# Altium project UAARG Autopilot.PrjPcb (part 3 of 3)
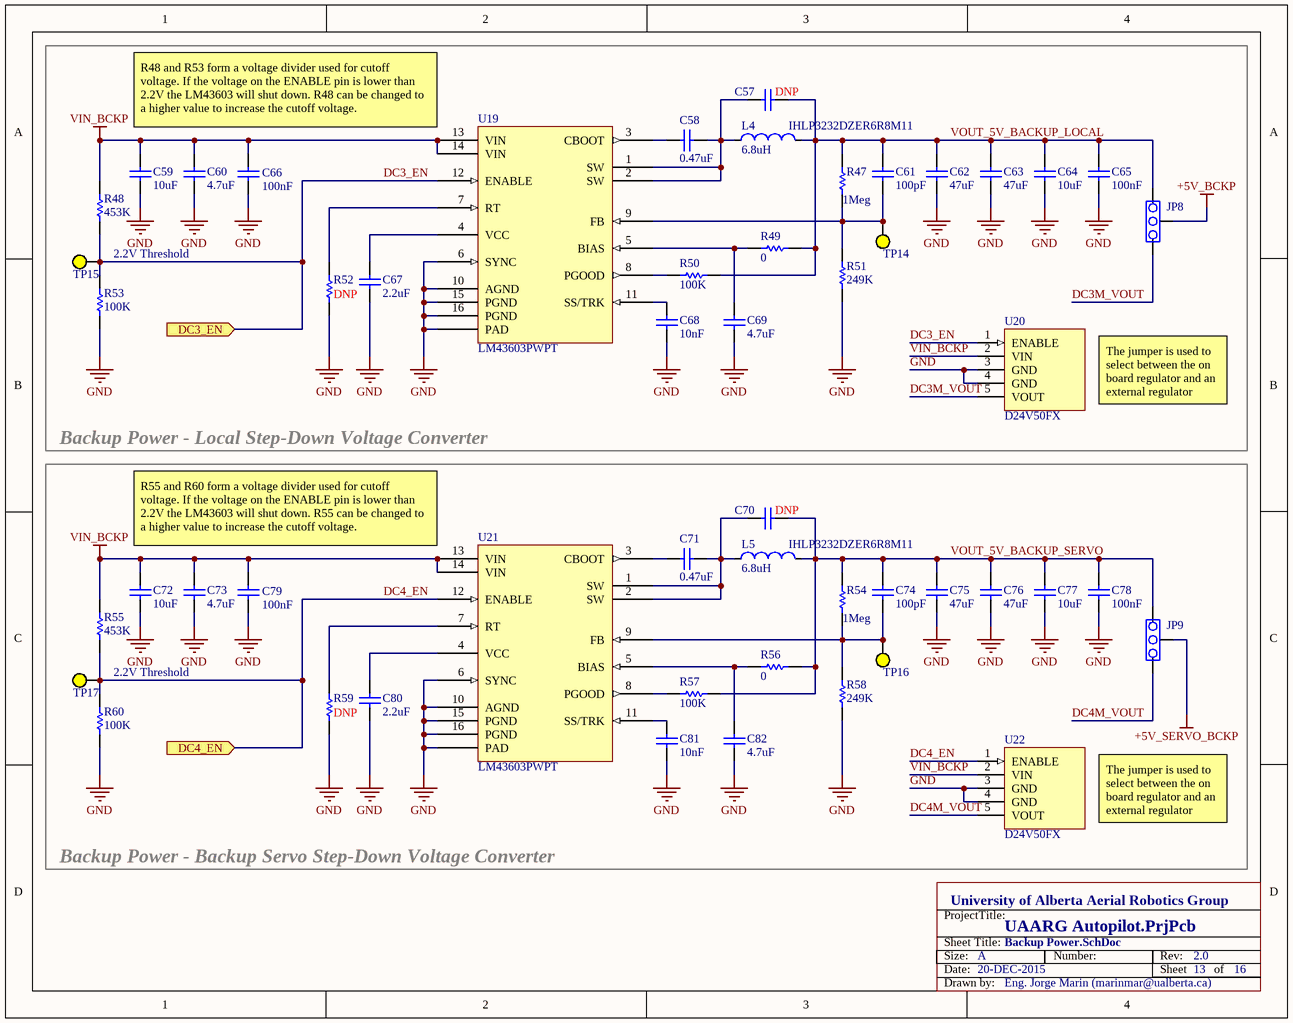
[diagram p16: Backup Power.SchDoc]

## Nets that join several sheets
+3V3: UAARG Autopilot (5 pins), Data Logger (JP7.2), Switches, UI (8 pins), MCU (12 pins), CAN, JTAG, LDO, USB (6 pins), Telemetry, I2C (10 pins), GPS (JP10.2), Connectors (7 pins)
+3V3_SENS: UAARG Autopilot (TP4.1), CAN, JTAG, LDO, USB (C24.2 U7.5), IMU (11 pins)
+5V: UAARG Autopilot (J5.1 J5.2 J9.8 TP2.1), CAN, JTAG, LDO, USB (6 pins), Telemetry, I2C (6 pins), Connectors (J12.1 SB3.3 SB4.3 SB5.3)
+5V_ALT: UAARG Autopilot (J5.47 J9.6), Connectors (J22.1)
+5V_BCKP: Power (5 pins), Backup Power (JP8.2)
+5V_EXT: Power (J2.5), Main Power (JP6.2)
+5V_MAIN: Power (D1.2 J2.7), Main Power (JP5.2)
+5V_SERVO_BCKP: Power (5 pins), Backup Power (JP9.2)
GND: UAARG Autopilot (9 pins), Data Logger (14 pins), Switches, UI (13 pins), MCU (18 pins), CAN, JTAG, LDO, USB (22 pins), Telemetry, I2C (5 pins), IMU (14 pins), GPS (14 pins), Connectors (22 pins), Power (5 pins), Main Power (40 pins), Backup Power (40 pins)
LV: UAARG Autopilot (J5.46), Telemetry, I2C (Q2.2 Q2.5 RN3.1 RN3.3), Connectors (J21.1)
SERVO_PWR: UAARG Autopilot (J9.4), Connectors (8 pins)
UART1_VCC: UAARG Autopilot (J5.8), Connectors (J10.1 J13.1 R7.2 SB4.2)
UART3_VCC: UAARG Autopilot (J5.10), Connectors (J6.1 R4.2 SB3.2)
UART5_VCC: UAARG Autopilot (J5.12), Connectors (J10.5 J14.1 R8.2 SB5.2)
VIN: Power (6 pins), Main Power (14 pins)
VIN_BCKP: Power (J1.3), Backup Power (14 pins)
ADC_1: UAARG Autopilot (J5.19), MCU (U1.11)
ADC_2: UAARG Autopilot (J5.21), MCU (U1.8)
ADC_3: UAARG Autopilot (J5.23), MCU (U1.9)
BACKUP_EN: Power (J2.4 J4.3 J8.4), Backup Power (10 pins)
BIND: Switches, UI (R44.1 S1.2), MCU (U1.28)
BOOT0: UAARG Autopilot (J5.9), MCU (R11.2 U1.60)
CAN.RX: MCU (U1.61), CAN, JTAG, LDO, USB (U5.4)
CAN.TX: MCU (U1.62), CAN, JTAG, LDO, USB (U5.1)
CS_BARO: MCU (U1.2), IMU (TP9.1 U2.4 U2.5)
CS_MPU: MCU (U1.33), IMU (TP8.1 U3.8)
D_N: UAARG Autopilot (J5.13), MCU (U1.44), CAN, JTAG, LDO, USB (R20.1)
D_P: UAARG Autopilot (J5.15), MCU (U1.45), CAN, JTAG, LDO, USB (R21.1)
DC1_EN: Power (J2.8), Main Power (5 pins)
DC2_EN: Power (J2.6), Main Power (5 pins)
GPIO1: UAARG Autopilot (J5.11), MCU (U1.26)
GPS_RX: GPS (U23.3), Connectors (JP4.1)
GPS_TX: GPS (U23.2), Connectors (JP2.1)
I2C1.SCL: Switches, UI (U16.9), MCU (U1.58), Telemetry, I2C (RN4.7 U13.3)
I2C1.SDA: Switches, UI (U16.12), MCU (U1.59), Telemetry, I2C (RN4.8 U13.4)
I2C2.SCL: MCU (U1.29), Telemetry, I2C (R40.2 RN5.7), Connectors (J10.11 J11.3)
I2C2.SDA: MCU (U1.30), Telemetry, I2C (R41.2 RN5.8), Connectors (J10.10 J11.2)
I2C2_5V.SCL: Telemetry, I2C (RN5.6 U14.6), Connectors (J12.3)
I2C2_5V.SDA: Telemetry, I2C (RN5.5 U14.5), Connectors (J12.2)
JTAG.RST: UAARG Autopilot (J5.7), MCU (C5.2 R12.1 U1.7), CAN, JTAG, LDO, USB (JTAG1.10)
JTAG.TCK: MCU (U1.49), CAN, JTAG, LDO, USB (JTAG1.4)
JTAG.TDI: MCU (U1.50), CAN, JTAG, LDO, USB (JTAG1.8)
JTAG.TDO: MCU (U1.55), CAN, JTAG, LDO, USB (JTAG1.6)
JTAG.TMS: MCU (U1.46), CAN, JTAG, LDO, USB (JTAG1.2)
LEDs.LED1: Switches, UI (LED1.2), MCU (U1.41)
LEDs.LED2: Switches, UI (LED2.2), MCU (U1.56)
LEDs.LED3: Switches, UI (LED3.2), MCU (U1.10)
LEDs.LED4: Switches, UI (LED4.2), MCU (U1.25)
LEDs.LED5: Switches, UI (LED5.2), MCU (U1.4)
LV_RX: UAARG Autopilot (J5.42), Telemetry, I2C (Q2.4 RN3.6), Connectors (J21.3)
LV_TX: UAARG Autopilot (J5.44), Telemetry, I2C (Q2.1 RN3.8), Connectors (J21.2)
M_EXT_EN: UAARG Autopilot (J5.43), Connectors (J21.4 R6.2 R10.2)
MAG_INT: MCU (U1.3), IMU (U4.15)
MISO: MCU (U1.35), IMU (TP6.1 U2.6 U3.9)
MOSI: MCU (U1.36), IMU (TP7.1 U2.7 U3.24)
MPU_INT: MCU (U1.57), IMU (R15.1 U3.12)
PA0: Switches, UI (U16.2), MCU (U1.14)
PA1: Switches, UI (U16.5), MCU (U1.15)
PA2: MCU (U1.16), Connectors (J20.2)
PA3: MCU (U1.17), Connectors (J20.3)
PA4: MCU (U1.20), Connectors (J19.6)
PA5: MCU (U1.21), Connectors (J19.5)
PA6: MCU (U1.22), Connectors (J19.4)
PA7: MCU (U1.23), Connectors (J19.3)
PA9: MCU (U1.42), CAN, JTAG, LDO, USB (R19.2), Connectors (J10.2 J13.2)
PA10: MCU (U1.43), Connectors (J10.3 J13.3 R7.1)
PB1: MCU (U1.27), Connectors (J19.7)
PB13: MCU (U1.34), IMU (TP5.1 U2.8 U3.23)
PC4: UAARG Autopilot (J5.45 R1.2), MCU (U1.24)
PC6: Switches, UI (U15.2), MCU (U1.37)
PC7: Switches, UI (U15.5), MCU (U1.38)
PC8: Switches, UI (U15.9), MCU (U1.39)
PC9: Switches, UI (U15.12), MCU (U1.40)
PC10: MCU (U1.51), Connectors (JP3.1)
PC11: MCU (U1.52), Connectors (JP1.1)
PC12: MCU (U1.53), Connectors (J10.6 J14.2)
PD2: MCU (U1.54), Connectors (J10.7 J14.3 R8.1)
S1: Switches, UI (RN8.1 U15.3), Connectors (RN1.4)
S2: Switches, UI (RN8.2 U15.6), Connectors (RN1.3)
S3: Switches, UI (RN8.3 U15.8), Connectors (RN1.2)
S4: Switches, UI (RN8.4 U15.11), Connectors (RN1.1)
S5: Switches, UI (RN9.1 U16.3), Connectors (RN2.4)
S6: Switches, UI (RN9.2 U16.6), Connectors (RN2.3)
S7: Switches, UI (RN9.3 U16.8), Connectors (RN2.2)
S8: Switches, UI (RN9.4 U16.11), Connectors (RN2.1)
SET1_EN: UAARG Autopilot (J7.8), Switches, UI (9 pins)
SET2_EN: UAARG Autopilot (J7.10), Switches, UI (9 pins)
UART3_RX_E: UAARG Autopilot (J5.24), Connectors (J6.3 JP1.2 JP2.2 R4.1)
UART3_TX_E: UAARG Autopilot (J5.22), Connectors (J6.2 JP3.2 JP4.2)
UART.UART2.RX: UAARG Autopilot (J5.20 SB2.3), Telemetry, I2C (EX1.2 U12.2)
UART.UART2.TX: UAARG Autopilot (J5.18 SB1.3), Data Logger (R46.1), Telemetry, I2C (EX1.3 U12.3)
UART_RX: UAARG Autopilot (SB2.2), Telemetry, I2C (Q2.3 RN3.7)
UART_TX: UAARG Autopilot (SB1.2), Telemetry, I2C (Q2.6 RN3.5)

## Assembly variants
w/o headers: not fitted C26 C39 C57 C70 C84 EX1 EX2 J1 J2 J3 J4 J5 J7 J8 J9 J10 JP1 JP2 JP3 JP4 JP5 JP6 JP7 JP8 JP9 JP10 R4 R11 R19 R20 R21 R29 R36 R52 R59 R62 R63 R64 U9 U11 U12 U20 U22
w/ headers: not fitted C26 C39 C57 C70 C84 R4 R19 R20 R21 R29 R36 R52 R59 R62 R63 R64 U9 U11 U12 U20 U22
Assembled: not fitted C26 C39 C57 C70 C84 R4 R19 R20 R21 R29 R36 R52 R59 R62 R63 R64 U9 U11 U20 U22